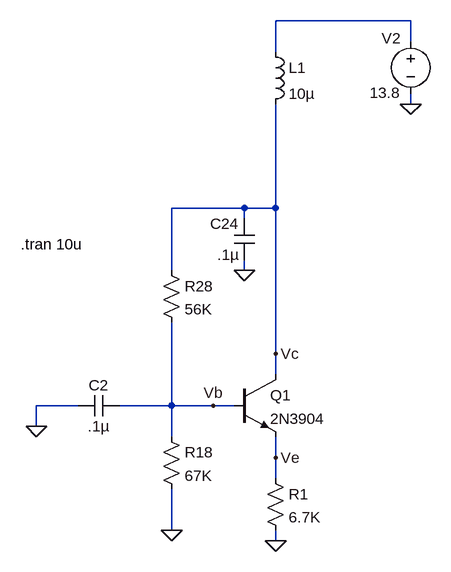
[diagram p0: schematic 2N3904 Bias (Michael).asc]
2N3904 Bias (Michael).asc, the LTspice schematic file:
Version 4
SHEET 1 3748 1540
WIRE -1104 -592 -1312 -592
WIRE -1104 -560 -1104 -592
WIRE -1312 -544 -1312 -592
WIRE -1104 -464 -1104 -480
WIRE -1360 -304 -1472 -304
WIRE -1312 -304 -1312 -464
WIRE -1312 -304 -1360 -304
WIRE -1360 -288 -1360 -304
WIRE -1472 -208 -1472 -304
WIRE -1360 -208 -1360 -224
WIRE -1312 -80 -1312 -304
WIRE -1312 -48 -1312 -80
WIRE -1616 0 -1680 0
WIRE -1472 0 -1472 -128
WIRE -1472 0 -1552 0
WIRE -1408 0 -1472 0
WIRE -1376 0 -1408 0
WIRE -1680 32 -1680 0
WIRE -1472 48 -1472 0
WIRE -1312 80 -1312 48
WIRE -1312 112 -1312 80
WIRE -1472 192 -1472 128
WIRE -1312 208 -1312 192
FLAG -1360 -208 0
FLAG -1472 192 0
FLAG -1408 0 Vb
FLAG -1312 -80 Vc
FLAG -1104 -464 0
FLAG -1312 208 0
FLAG -1312 80 Ve
FLAG -1680 32 0
SYMBOL npn -1376 -48 R0
SYMATTR InstName Q1
SYMATTR Value 2N3904
SYMBOL res -1488 32 R0
SYMATTR InstName R18
SYMATTR Value 67K
SYMBOL res -1488 -224 R0
SYMATTR InstName R28
SYMATTR Value 56K
SYMBOL cap -1344 -224 R180
WINDOW 0 24 56 Left 2
WINDOW 3 24 8 Left 2
SYMATTR InstName C24
SYMATTR Value .1µ
SYMBOL voltage -1104 -576 R0
WINDOW 0 -45 11 Left 2
WINDOW 3 -63 95 Left 2
WINDOW 123 -97 119 Left 2
WINDOW 39 -214 151 Left 2
SYMATTR InstName V2
SYMATTR Value 13.8
SYMBOL res -1328 96 R0
SYMATTR InstName R1
SYMATTR Value 6.7K
SYMBOL cap -1552 -16 R90
WINDOW 0 0 32 VBottom 2
WINDOW 3 32 32 VTop 2
SYMATTR InstName C2
SYMATTR Value .1µ
SYMBOL ind -1328 -560 R0
SYMATTR InstName L1
SYMATTR Value 10µ
TEXT -1704 -248 Left 2 !.tran 10u

The netlist it stands for:
* 2N3904 Bias (Michael).asc
Q1 Vc Vb Ve 0 2N3904
R18 Vb 0 67K
R28 Vc Vb 56K
C24 0 Vc .1µ
V2 N001 0 13.8
R1 Ve 0 6.7K
C2 Vb 0 .1µ
L1 N001 Vc 10µ
.model NPN NPN
.model PNP PNP
.lib standard.bjt
.tran 10u
.backanno
.end